# Altium schematic sheet 智能家居.SchDoc
size A4; SheetNumber: 1; SheetTotal: 2; SPICEModelCacheQIYRVTXZ: <root> / <DocumentId>QIYRVTXZ</DocumentId> / </root>
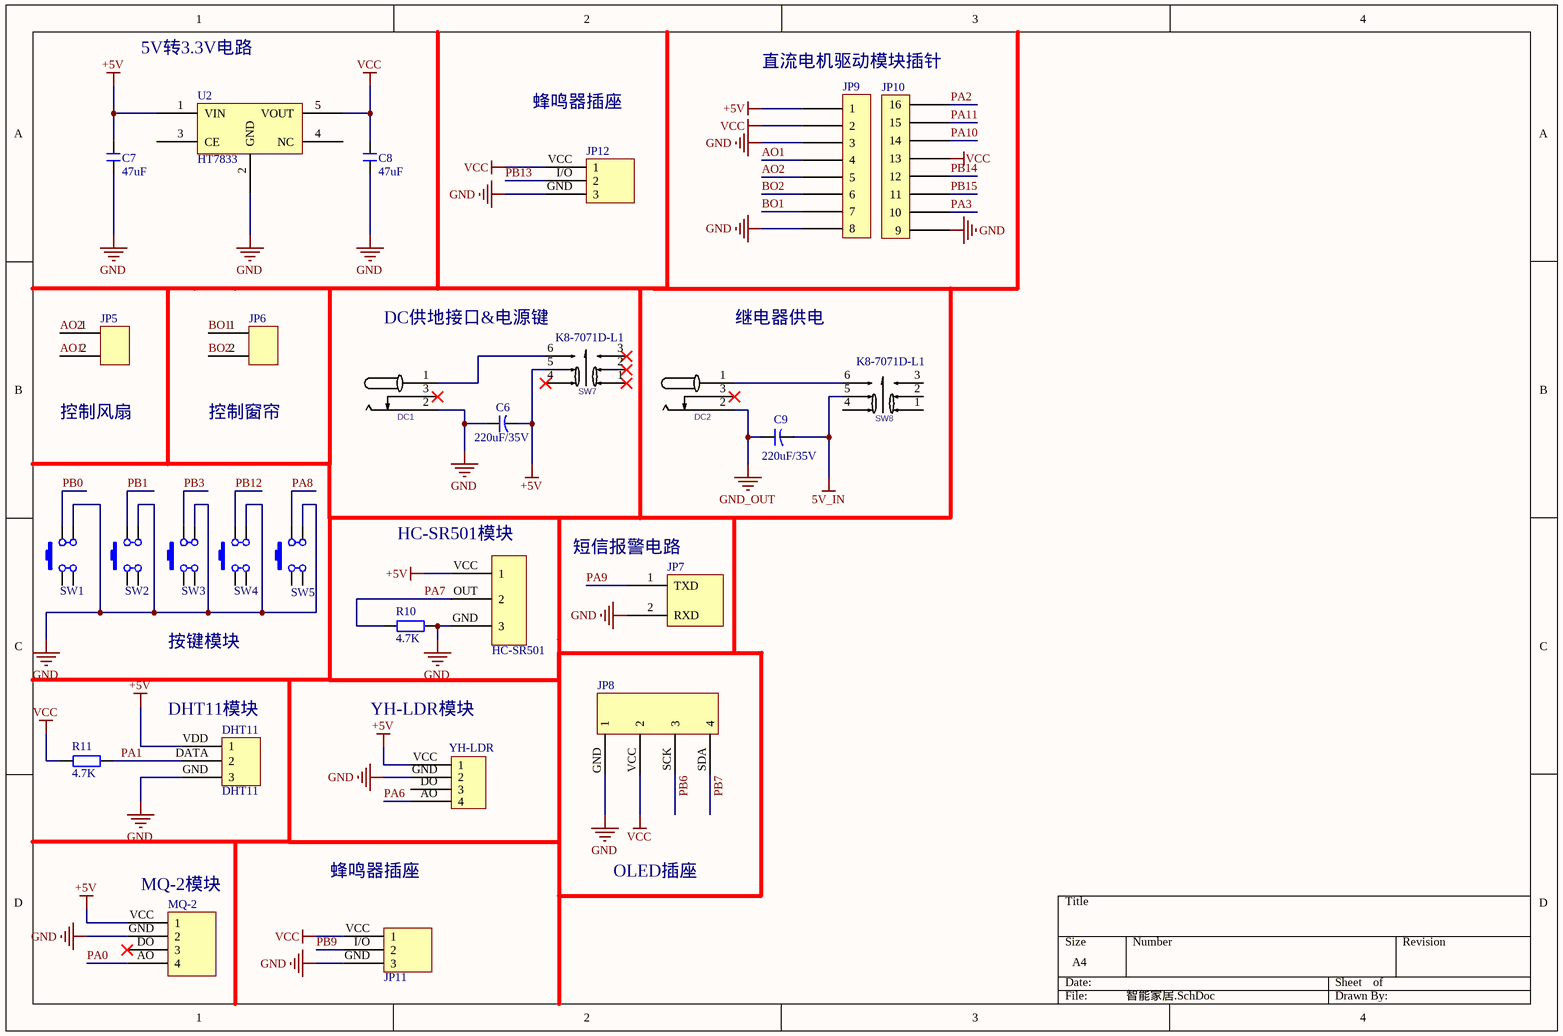
[diagram p0: 智能家居.SchDoc]

## Parts
C6  CAP2  [CAP]  (value not drawn)
C7  47uF  [47uF]
C8  47uF  [47uF]
C9  220uF/35V  [CAP]
DC1  DC005  [DC005]  (value not drawn)
DC2  DC005  [DC005]  (value not drawn)
DHT11  DHT11  [HAR1X3-3]
HC-SR1  HC-SR501  [HDR1X3-2]
JP5  JP1  [HDR1X2]  (value not drawn)
JP6  JP1  [HDR1X2]  (value not drawn)
JP7  JP2  [HDR1X2]  (value not drawn)
JP8  JP7  [HAR1X4-2]  (value not drawn)
JP9  JP5  [HDR1X8]  (value not drawn)
JP10  JP6  [HDR1X8-2]  (value not drawn)
JP11  JP11  [HDR1X3-3]  (value not drawn)
JP12  JP12  [HDR1X3-3]  (value not drawn)
MQ-2  MQ-2  [HAR1X4-4]  (value not drawn)
R10  4.7K  [R 0805_L]
R11  4.7K  [R 0805_L]
SW1  KEY  [KEY]  (value not drawn)
SW2  KEY  [KEY]  (value not drawn)
SW3  KEY  [KEY]  (value not drawn)
SW4  KEY  [KEY]  (value not drawn)
SW5  KEY  [KEY]  (value not drawn)
SW7  K8-7071D-L1  [K8]  (value not drawn)
SW8  K8-7071D-L1  [K8]
U2  HT7833  [HT7833]
YH-LDR1  YH-LDR  [HAR1X4-4]

## Nets
5V_IN: C9.1 SW8.5
+5V: C6.1 C7.2 DHT11.VDD(1) HC-SR1.VCC(1) JP9.1 MQ-2.VCC(1) SW7.5 U2.1(VIN) YH-LDR1.VCC(1)
GND: C6.2 C7.1 C8.1 DC1.2 DHT11.GND(3) HC-SR1.GND(3) JP7.2(RXD) JP8.GND(1) JP9.3 JP9.8 JP10.9 JP11.GND(3) JP12.GND(3) MQ-2.GND(2) R10.2 SW1.4 SW2.4 SW3.4 SW4.4 SW5.4 U2.2(GND) YH-LDR1.GND(2)
GND_OUT: C9.2 DC2.2
VCC: C8.2 JP8.VCC(2) JP9.2 JP10.13 JP11.VCC(1) JP12.VCC(1) R11.2 U2.5(VOUT)
AO1: JP5.2 JP9.4
AO2: JP5.1 JP9.5
BO1: JP6.1 JP9.7
BO2: JP6.2 JP9.6
PA0: MQ-2.AO(4)
PA1: DHT11.DATA(2) R11.1
PA2: JP10.16
PA3: JP10.10
PA6: YH-LDR1.AO(4)
PA7: HC-SR1.OUT(2) R10.1
PA8: SW5.2
PA9: JP7.1(TXD)
PA10: JP10.14
PA11: JP10.15
PB0: SW1.2
PB1: SW2.2
PB3: SW3.2
PB6: JP8.SCK(3)
PB7: JP8.SDA(4)
PB9: JP11.I/O(2)
PB12: SW4.2
PB13: JP12.I/O(2)
PB14: JP10.12
PB15: JP10.11
NetDC1_1: DC1.1 SW7.6
NetDC2_1: DC2.1 SW8.6

Not connected (* = marked no-connect by the designer): DC1 3*; DC2 3*; MQ-2 DO(3)*; SW1 1 3; SW2 1 3; SW3 1 3; SW4 1 3; SW5 1 3; SW7 1* 2* 3* 4*; SW8 1 2 3 4; U2 3(CE) 4(NC); YH-LDR1 DO(3)

## Notes on the sheet
- 5V转3.3V电路
- 蜂鸣器插座
- (near JP9) 直流电机驱动模块插针
- DC供地接口&电源键
- (near SW7) K8-7071D-L1
- 继电器供电
- (near JP5) 控制风扇
- (near JP6) 控制窗帘
- (near C6) 220uF/35V
- (near HC-SR1) HC-SR501模块
- (near JP7) 短信报警电路
- 按键模块
- (near DHT11) DHT11模块
- (near YH-LDR1) YH-LDR模块
- (near MQ-2) MQ-2模块
- OLED插座

## Library data of the parts
C7 C8 = C: 贴片电容; BOM名称: 无极性贴片电容; 淘宝ID: 封装库来自淘宝 ID：黄晶宝石; 联系售后，技术支持: https://shop463601444.taobao.com; 唯一出售店铺网址: https://shop463601444.taobao.com
C9 = CAP2
DC1 DC2 = DC005: Manufacturer: SHOU HAN(首韩); Symbol: DC005_C431533; Add into BOM: yes; Connector Type: DC电源插座; Inside Contact Diameter: 2mm; Outside Contact Diameter: 6.3mm; Current Rating (Max): 500mA; Voltage Rating (Max): 30V; Device: DC005; Supplier: LCSC; Supplier Part: C431533; Manufacturer Part: DC005; JLCPCB Part Class: Extended Part; LCSC Part Name: DC电源插座 内径:2mm 外径:6.3mm; Supplier Footprint: 插件; Datasheet: https://atta.szlcsc.com/upload/public/pdf/source/20190925/C431533_4751811035784AC1D38EBC85F7905E99.pdf; Convert to PCB: yes; Mounting Style: 弯插; Operating Temperature Range: -40℃~+55℃
DHT11 = DHT11: 温湿度传感器
HC-SR1 = HC-SR501: 人体红外热释电传感器
JP5 JP6 = JP1: 插针
JP7 = JP2: USB转串口
JP8 = JP7: OLED引脚插针
JP9 = JP5: 直流电机驱动模块插针第一列
JP10 = JP6: 直流电机驱动模块第二列
JP11 = JP11: 蜂鸣器插针
MQ-2 = MQ-2: 烟雾传感器
R10 R11 = R: 贴片电阻; 版权归属: 来自淘宝 ID：黄晶宝石; 封装库来自淘宝卖家 ID：黄晶宝石: 其他店铺购入均为盗版，不享受售后技术支持服务，请立即申请退款; BOM名称: 贴片电阻; 联系售后: https://shop463601444.taobao.com
SW1-SW5 = KEY: 普通按键
SW7 SW8 = K8-7071D-L1: Manufacturer: 韩国韩荣; Add into BOM: yes; Contact Current: 100mA; Voltage Rating (DC): 30V; Insulation Resistance: 100mΩ; Self Lock / No Lock: 自锁; Actuator Style: 矩形柱塞; Actuator/Cap Color: 蓝色; With Lamp: 无; Pin Style: PC引脚; Operating Force: 230gf@±50gf; Mechanical Life: 100000; Symbol: K8-7071D-L1; Device: K8-7071D-L1; LCSC Part Name: K8-7071D-L1; Supplier Part: C111759; Manufacturer Part: K8-7071D-L1; Supplier Footprint: 插件; JLCPCB Part Class: Extended Part; Datasheet: https://atta.szlcsc.com/upload/public/pdf/source/20210810/1E23F383FB1C24682B487C492BB0592B.pdf; Supplier: LCSC; Convert to PCB: yes; Voltage Rating (AC): -; Mounting Style: 直插; IP Rating: -; Operating Temperature: -25℃~+80℃
U2 = HT7833: 5V转3.3V电路
YH-LDR1 = YH-LDR: 光敏传感器